# EAGLE schematic prssine (EAGLE 7.7.0)
AUTHOR: Uros Platise; TITLE: PRS Sine Generator

## Sheet 1 of 2
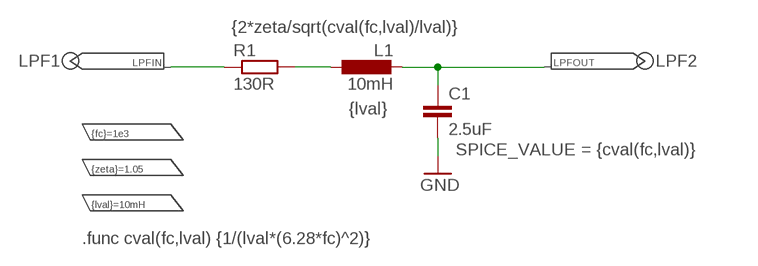
[diagram p0: schematic, sheet 1]

### Parts
C1  2.5uF  C-EUC0402  [C0402]
L1  10mH  L-EU0204/5  [0204/5]
R1  130R  R-EU_R0402  [R0402]

### Nets
GND: C1.2 ; also sheet 2
LPFIN: R1.1 ; also sheet 2
LPFOUT: C1.1 L1.2
N$1: L1.1 R1.2

### Notes on the sheet
- .func cval(fc,lval) {1/(lval*(6.28*fc)^2)}

## Sheet 2 of 2
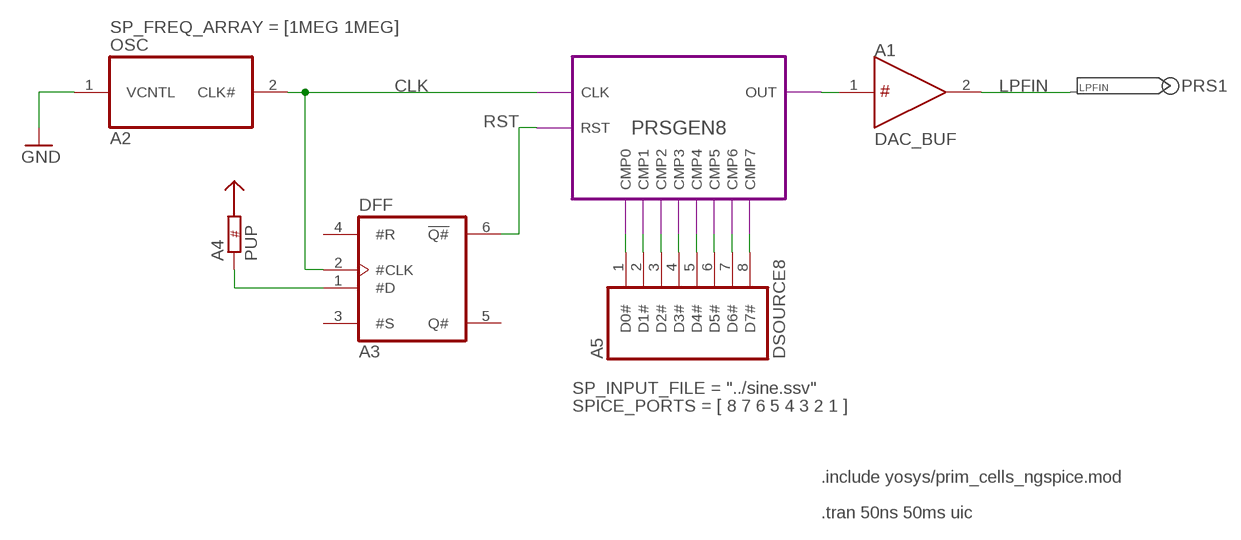
[diagram p1: schematic, sheet 2]

### Parts
A1  DAC_BUF  [SPICE2]
A2  OSC  [SPICE2]
A3  DFF  [SPICE6]
A4  PUP  [SPICE1]
A5  DSOURCE8  [SPICE8]

### Module instances
PRSGEN8 = PRSGEN8

### Nets
CLK: A2.2(CLK#) A3.2(#CLK) ; port PRSGEN8.CLK
GND: A2.1(VCNTL) ; also sheet 1
LPFIN: A1.2(AOUT) ; also sheet 1
N$5: A5.1(D0#) ; port PRSGEN8.CMP0
N$6: A3.1(#D) A4.1
N$7: A5.2(D1#) ; port PRSGEN8.CMP1
N$8: A5.3(D2#) ; port PRSGEN8.CMP2
N$9: A5.4(D3#) ; port PRSGEN8.CMP3
N$10: A5.5(D4#) ; port PRSGEN8.CMP4
N$11: A5.6(D5#) ; port PRSGEN8.CMP5
N$12: A5.7(D6#) ; port PRSGEN8.CMP6
N$13: A5.8(D7#) ; port PRSGEN8.CMP7
OUT: A1.1(DIN) ; port PRSGEN8.OUT
RST: A3.6(!Q#) ; port PRSGEN8.RST
Unconnected: A3.3(#S) A3.4(#R) A3.5(Q#)

### Notes on the sheet
- .include yosys/prim_cells_ngspice.mod
- .tran 50ns 50ms uic

## Library data of the parts
A1 = ngspice:DAC_BUF: The dac_bridge is the first of two node bridge devices designed to allow for the ready transfer of digital information to analog values and back again. The second device is the adc_bridge (which takes an analog value and maps it to a digital one).The dac_bridge takes as input a digital value from a digital node. This value by definition may take on only one of the values “0”, “1” or “U”. The dac_bridge then outputs the value “out_low”, “out_high” or “out_undef”, or ramps linearly toward one of these “final” values from its current analog output level. The speed at which this ramping occurs depends on the valuesof “t_rise” and “t_fall”. These parameters are interpreted by the model such that the rise or fall slope generated is always constant. Note that the dac_bridge includes test code in its cfunc.mod file for determining the presence of the out_undef parameter. If this parameter is not specified by you, and if out_high and out_low values are specified, then out_undef is assigned the value of the arithmetic mean of out_high and out_low. This simplifies coding of output buffers, where typically a logic family will include an out_low and out_high voltage, but not an out_undef value. This model also posts an input load value (in farads) based on the parameter input load.; SPICE_MODEL: .model >VALUE dac_bridge(out_low out_high out_undef input_load t_rise t_fall); SPICE_PORTS: [ 1 ] [ 2 ]; SP_INPUT_LOAD: 1pF; SP_OUT_HIGH: 1V; SP_OUT_LOW: 0V; SP_OUT_UNDEF: 0.5V; SP_T_FALL: 1ns; SP_T_RISE: 1ns
A2 = ngspice:OSC: The digital oscillator is a hybrid model which accepts as input a voltage or current. This input is compared to the voltage-to-frequency transfer characteristic specified by the cntl_array/freq_array coordinate pairs, and a frequency is obtained which represents a linear interpolation or extrapolation based on those pairs. A digital time-varying signal is then produced with this fundamental frequency. The output waveform, which is the equivalent of a digital clock signal, has rise and fall delays which can be specified independently. In addition, the duty cycle and the phase of the waveform are also variable and can be set by you.; SPICE_MODEL: .model >VALUE d_osc(cntl_array freq_array duty_cycle init_phase rise_delay fall_delay); SP_CNTL_ARRAY: [0 5]; SP_DUTY_CYCLE: 0.5; SP_FALL_DELAY: 1ns; SP_FREQ_ARRAY: [1MEG 1MEG]; SP_INIT_PHASE: 0; SP_RISE_DELAY: 1ns
A3 = ngspice:DFF: The digital d-type flip flop is a one-bit, edge-triggered storage element which will store data whenever the clk input line transitions from low to high (ZERO to ONE). In addition, asynchronous set and reset signals exist, and each of the three methods of changing the stored output of the d_dff have separate load values and delays associated with them. Additionally, you may specify separate rise and fall delay values that are added to those specified for the input lines; these allow for more faithful reproduction of the output characteristics of different IC fabrication technologies. Note that any UNKNOWN input on the set or reset lines immediately results in an UNKNOWN output.; SPICE_MODEL: .model >VALUE d_dff (clk_delay set_delay reset_delay data_load clk_load set_load reset_load rise_delay fall_delay ic); SP_CLK_DELAY: 1ns; SP_CLK_LOAD: 1pF; SP_DATA_LOAD: 1pF; SP_FALL_DELAY: 1ns; SP_IC: 0; SP_RESET_DELAY: 1ns; SP_RESET_LOAD: 1pF; SP_RISE_DELAY: 1ns; SP_SET_DELAY: 1ns; SP_SET_LOAD: 1pF
A4 = ngspice:PUP: The digital pullup resistor is a device which emulates the behavior of an analog resistance value tied to a high voltage level. The pullup may be used in conjunction with tristate buffers to provide open-collector wired “or” constructs, or any other logical constructs which rely on a resistive pullup common to many tristated output devices. The model posts an input load value (in farads) based on the parameters “load”.; SPICE_MODEL: .model >VALUE d_pullup( load ); SP_LOAD: 1pF
A5 = ngspice:DSOURCE8: The digital source provides for straightforward descriptions of digital signal vectors in a tabular format. The model reads input from the input file and, at the times specified in the file, generates the inputs along with the strengths listed. The format of the input file is as shown below. Note that comment lines are delineated through the use of a single “*” character in the first column of a line. This is similar to the way the SPICE program handles comments. 0.0000 Uu Uu Uu 1.234e-9 0s 1s 0z 1.376e-9 1s 0s 0z 2.5e-7 0s 0s 0z Note that in the example shown, whitespace (any combination of blanks, tabs, commas) is used to separate the time and state/strength tokens. The order of the input columns is important; the first column is always interpreted to mean “time”. The second through the N’th columns map to the out[0] through out[N-2] output nodes. A non-commented line which does not contain enough tokens to completely define all outputs for the digital source will cause an error. Also, time values must increase monotonically or an error will result in reading the source file. Errors will also occur if a line exists in source.txt which is neither a comment nor vector line. The only exception to this is in the case of a line that is completely blank; this is treated as a comment (note that such lines often occur at the end of text within a file; ignoring these in particular prevents nuisance errors on the part of the simulator).; SPICE_MODEL: .model >VALUE d_source(input_file input_load); SPICE_PORTS: [ 8 7 6 5 4 3 2 1 ]; SP_INPUT_FILE: "../sine.ssv"; SP_INPUT_LOAD: 1e-12
C1 = rcl:C-EU: CAPACITOR, European symbol; SPICE_VALUE: {cval(fc,lval)}
L1 = rcl:L-EU: INDUCTOR, European symbol; SPICE_VALUE: {lval}
R1 = rcl:R-EU_: RESISTOR, European symbol; SPICE_VALUE: {2*zeta/sqrt(cval(fc,lval)/lval)}

## Module PRSGEN8
Ports: CLK(in) RST(in) CMP0(in) CMP1(in) CMP2(in) CMP3(in) CMP4(in) CMP5(in) CMP6(in) CMP7(in) OUT(out)
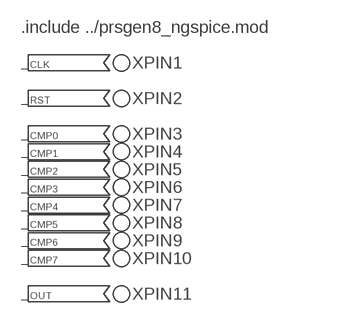
[diagram p2: schematic, module PRSGEN8, sheet 1]

### Notes on the sheet
- .include ../prsgen8_ngspice.mod

### Library data of the parts